# EAGLE design GPSClockISA (EAGLE 7.7.0)
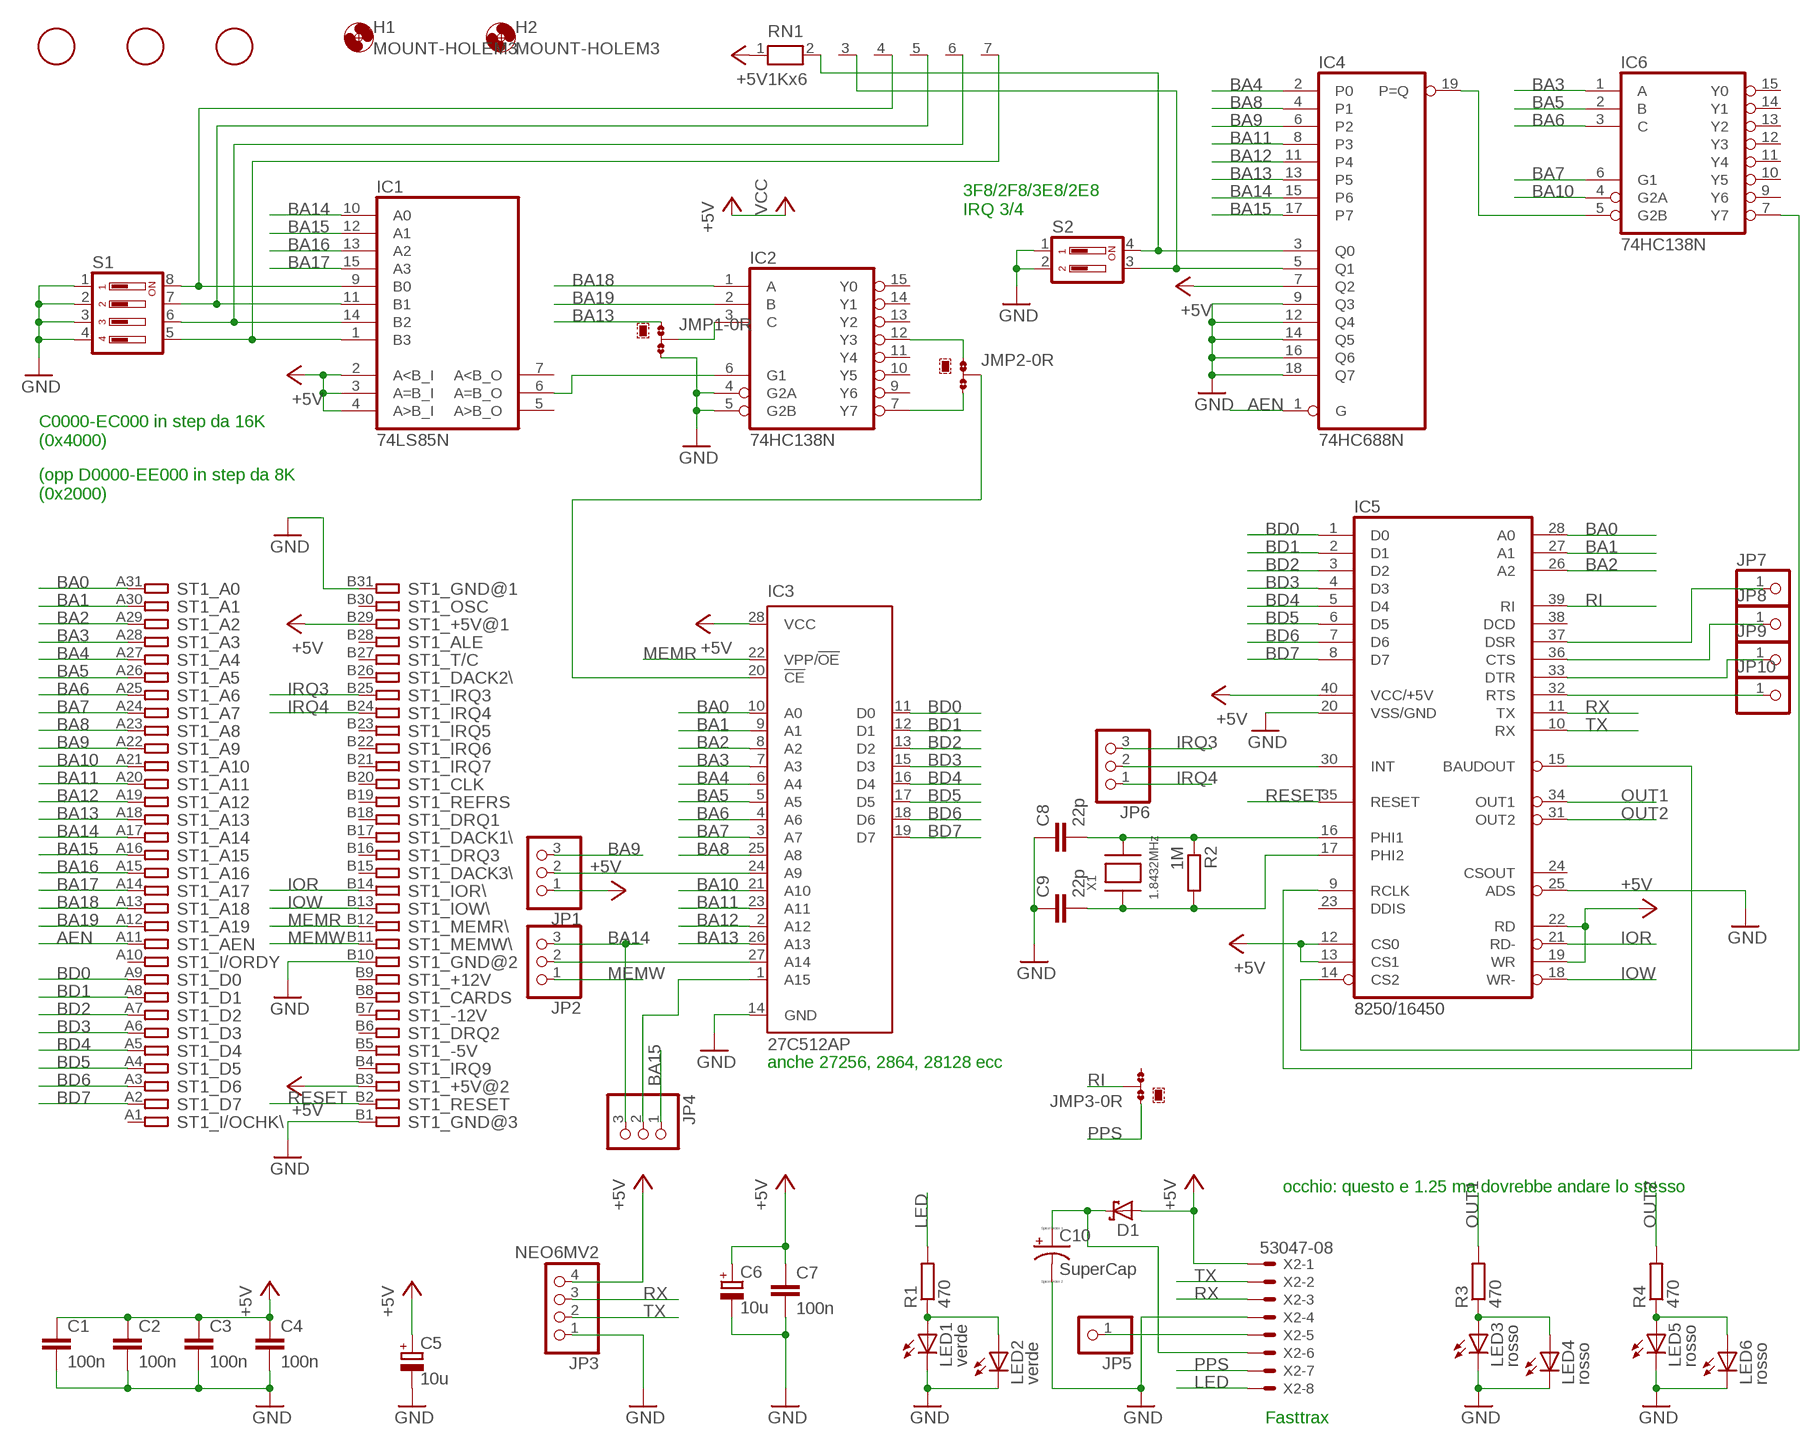
[diagram p0: schematic, sheet 1]

## Parts
C1  100n  C-EUC0805  [C0805]
C2  100n  C-EUC0805  [C0805]
C3  100n  C-EUC0805  [C0805]
C4  100n  C-EUC0805  [C0805]
C5  10u  CPOL-EUSMCD  [SMC_D]
C6  10u  CPOL-EUSMCC  [SMC_C]
C7  100n  C-EUC0805  [C0805]
C8  22p  C-EUC0805  [C0805]
C9  22p  C-EUC0805  [C0805]
C10  SuperCap  CPOL-USE10-22.5  [EB22,5D]
D1  SCHOTTKY-DIODESMC  [SMC]
F1  FIDUCIAL  [FIDUCIAL_1MM]
F2  FIDUCIAL  [FIDUCIAL_1MM]
F3  FIDUCIAL  [FIDUCIAL_1MM]
H1  MOUNT-HOLEM3  [M3]
H2  MOUNT-HOLEM3  [M3]
IC1  74LS85N  [DIL16]
IC2  74HC138N  [DIL16]
IC3  27C512AP  [DIL28-6]
IC4  74HC688N  [DIL20]
IC5  8250/16450  8250  [DIL40]
IC6  74HC138N  [DIL16]
JMP1  0R-JUMPC  [C0R-JMP]
JMP2  0R-JUMPC  [C0R-JMP]
JMP3  0R-JUMPC  [C0R-JMP]
JP1  PINHD-1X03_2.54  [1X03]
JP2  PINHD-1X03_2.54  [1X03]
JP3  NEO6MV2  PINHD-1X4  [1X04]
JP4  PINHD-1X03_2.54  [1X03]
JP5  PINHD-1X1  [1X01]
JP6  PINHD-1X03_2.54  [1X03]
JP7  PINHD-1X1  [1X01]
JP8  PINHD-1X1  [1X01]
JP9  PINHD-1X1  [1X01]
JP10  PINHD-1X1  [1X01]
LED1  verde  LEDCHIPLED_0805  [CHIPLED_0805]
LED2  verde  LED3MM  [LED3MM]
LED3  rosso  LEDCHIPLED_0805  [CHIPLED_0805]
LED4  rosso  LED3MM  [LED3MM]
LED5  rosso  LEDCHIPLED_0805  [CHIPLED_0805]
LED6  rosso  LED3MM  [LED3MM]
R1  470  R-EU_R0805  [R0805]
R2  1M  R-EU_R0805  [R0805]
R3  470  R-EU_R0805  [R0805]
R4  470  R-EU_R0805  [R0805]
RN1  1Kx6  RN06  [RN-7]
S1  DIP04YL  [DIP04YL]
S2  DIP02YL  [DIP02YL]
ST1  IBM8BIT  [IBM8BIT]
X1  1.8432MHz  XTALNX8045  [NX8045]
X2  53047-08  [53047-08]

## Nets
+5V [+3V3]: C1.1 C2.1 C3.1 C4.1 C5.+ C6.+ C7.1 D1.A IC1.2(A<B_I) IC1.3(A=B_I) IC1.4(A>B_I) IC3.28(VCC) IC4.7(Q2) IC5.12(CS0) IC5.13(CS1) IC5.19(WR) IC5.22(RD) IC5.40(VCC/+5V) JP1.1 JP3.4 RN1.1 ST1.B3 ST1.B29 X2.1
AEN: IC4.1(G) ST1.A11
BA0: IC3.10(A0) IC5.28(A0) ST1.A31
BA1: IC3.9(A1) IC5.27(A1) ST1.A30
BA2: IC3.8(A2) IC5.26(A2) ST1.A29
BA3: IC3.7(A3) IC6.1(A) ST1.A28
BA4: IC3.6(A4) IC4.2(P0) ST1.A27
BA5: IC3.5(A5) IC6.2(B) ST1.A26
BA6: IC3.4(A6) IC6.3(C) ST1.A25
BA7: IC3.3(A7) IC6.6(G1) ST1.A24
BA8: IC3.25(A8) IC4.4(P1) ST1.A23
BA9: IC4.6(P2) JP1.3 ST1.A22
BA10: IC3.21(A10) IC6.4(G2A) ST1.A21
BA11: IC3.23(A11) IC4.8(P3) ST1.A20
BA12: IC3.2(A12) IC4.11(P4) ST1.A19
BA13: IC3.26(A13) IC4.13(P5) JMP1.1 ST1.A18
BA14: IC1.10(A0) IC4.15(P6) JP2.3 JP4.3 ST1.A17
BA15: IC1.12(A1) IC4.17(P7) JP4.1 ST1.A16
BA16: IC1.13(A2) ST1.A15
BA17: IC1.15(A3) ST1.A14
BA18: IC2.1(A) ST1.A13
BA19: IC2.2(B) ST1.A12
BD0: IC3.11(D0) IC5.1(D0) ST1.A9
BD1: IC3.12(D1) IC5.2(D1) ST1.A8
BD2: IC3.13(D2) IC5.3(D2) ST1.A7
BD3: IC3.15(D3) IC5.4(D3) ST1.A6
BD4: IC3.16(D4) IC5.5(D4) ST1.A5
BD5: IC3.17(D5) IC5.6(D5) ST1.A4
BD6: IC3.18(D6) IC5.7(D6) ST1.A3
BD7: IC3.19(D7) IC5.8(D7) ST1.A2
GND [N3]: C1.2 C2.2 C3.2 C4.2 C5.- C6.- C7.2 C8.1 C9.1 C10.- IC2.4(G2A) IC2.5(G2B) IC3.14(GND) IC4.9(Q3) IC4.12(Q4) IC4.14(Q5) IC4.16(Q6) IC4.18(Q7) IC5.20(VSS/GND) IC5.25(ADS) JMP1.3 JP3.1 LED1.C LED2.K(C) LED3.C LED4.K(C) LED5.C LED6.K(C) S1.1 S1.2 S1.3 S1.4 S2.1 S2.2 ST1.B1 ST1.B10 ST1.B31 X2.4
IOR: IC5.21(RD-) ST1.B14
IOW: IC5.18(WR-) ST1.B13
IRQ3: JP6.3 ST1.B25
IRQ4: JP6.1 ST1.B24
LED: R1.2 X2.8
MEMR: IC3.22(VPP/!OE) ST1.B12
MEMW: JP2.1 ST1.B11
N$1: JP5.1 X2.5
N$2: LED3.A LED4.A R3.1
N$3: LED5.A LED6.A R4.1
N$4: IC1.9(B0) RN1.4 S1.8
N$5 [+3V3]: C10.+ D1.C X2.6
N$6: IC1.11(B1) RN1.5 S1.7
N$7: IC5.30(INT) JP6.2
N$8: IC1.14(B2) RN1.6 S1.6
N$9: LED1.A LED2.A R1.1
N$10: IC1.1(B3) RN1.7 S1.5
N$11: IC2.12(Y3) JMP2.1
N$12: IC4.19(P=Q) IC6.5(G2B)
N$13: IC3.20(!CE) JMP2.2
N$14: IC5.9(RCLK) IC5.15(BAUDOUT)
N$15: C9.2 IC5.17(PHI2) R2.2 X1.P$1
N$16: IC3.27(A14) JP2.2
N$17: C8.2 IC5.16(PHI1) R2.1 X1.P$2
N$18: IC2.3(C) JMP1.2
N$19: IC3.1(A15) JP4.2
N$20: IC4.5(Q1) RN1.3 S2.3
N$21: IC4.3(Q0) RN1.2 S2.4
N$22: IC3.24(A9) JP1.2
N$23: IC1.6(A=B_O) IC2.6(G1)
N$24: IC2.7(Y7) JMP2.3
N$25: IC5.14(CS2) IC6.7(Y7)
N$26: IC5.37(DSR) JP7.1
N$27: IC5.36(CTS) JP8.1
N$28: IC5.33(DTR) JP9.1
N$29: IC5.32(RTS) JP10.1
OUT1: IC5.34(OUT1) R3.2
OUT2: IC5.31(OUT2) R4.2
PPS: JMP3.1 X2.7
RESET: IC5.35(RESET) ST1.B2
RI: IC5.39(RI) JMP3.2
RX: IC5.11(TX) JP3.3 X2.3
TX: IC5.10(RX) JP3.2 X2.2
Unconnected: IC1.5(A>B_O) IC1.7(A<B_O) IC2.9(Y6) IC2.10(Y5) IC2.11(Y4) IC2.13(Y2) IC2.14(Y1) IC2.15(Y0) IC5.23(DDIS) IC5.24(CSOUT) IC5.38(DCD) IC6.9(Y6) IC6.10(Y5) IC6.11(Y4) IC6.12(Y3) IC6.13(Y2) IC6.14(Y1) IC6.15(Y0) JMP3.3 ST1.A1 ST1.A10 ST1.B4 ST1.B5 ST1.B6 ST1.B7 ST1.B8 ST1.B9 ST1.B15 ST1.B16 ST1.B17 ST1.B18 ST1.B19 ST1.B20 ST1.B21 ST1.B22 ST1.B23 ST1.B26 ST1.B27 ST1.B28 ST1.B30

## Notes on the sheet
- 3F8/2F8/3E8/2E8
  IRQ 3/4
- C0000-EC000 in step da 16K
  (0x4000)
- (opp D0000-EE000 in step da 8K
  (0x2000)
- anche 27256, 2864, 28128 ecc
- occhio: questo e 1.25 ma dovrebbe andare lo stesso
- Fasttrax

## Power pins joined to a net without a drawn wire
GND: IC1.8(GND) IC2.8(GND) IC4.10(GND) IC6.8(GND)
VCC: IC1.16(VCC) IC2.16(VCC) IC4.20(VCC) IC6.16(VCC)

## Library data of the parts
C1-C4 C7-C9 = resistor:C-EU: CAPACITOR, European symbol
C5 C6 = resistor:CPOL-EU: POLARIZED CAPACITOR, European symbol
C10 = resistor:CPOL-US: POLARIZED CAPACITOR, American symbol
D1 = diode:SCHOTTKY-DIODE: Schottky Diode
F1-F3 = adafruit:FIDUCIAL: For use by pick and place machines to calibrate the vision/machine, 1mm By microbuilder.eu
H1 H2 = holes:MOUNT-HOLE: MOUNTING HOLE with drill center marker
IC1 = 74xx-eu:74*85: 4-bit magnitude COMPARATOR
IC2 IC6 = 74xx-eu:74*138: 3-line to 8-line DECODER/DEMULTIPLEXER
IC3 = microchip2:27*512A: CMOS EPROM 512 K (64 K x 8); MPN: M27C512-90B6; OC_FARNELL: 1642690; OC_NEWARK: 20M6389
IC4 = 74xx-eu:74*688: 8-bit MAGNITUDE/IDENTITY COMPARATOR, totem pole
IC5 = micro-intel:8250: 8250 UART; OC_FARNELL: unknown; OC_NEWARK: unknown
JMP1-JMP3 = jump-0r-smd:0R-JUMP: SMD 0R 0805 Jumper
JP1 JP2 JP4 JP6 = pinhead-2:PINHD-1X03: PIN HEADER
JP3 = pinhead:PINHD-1X4: PIN HEADER
JP5 JP7-JP10 = pinhead:PINHD-1X1: PIN HEADER
LED1 LED3 LED5 = led:LED: LED
LED2 LED4 LED6 = adafruit:LED: LED
R1-R4 = resistor:R-EU_: RESISTOR, European symbol
RN1 = resistor-net:RN06: RESISTOR NETWORK; OC_FARNELL: unknown; OC_NEWARK: unknown
S1 = switch-dil:DIP04YL: DIL/CODE SWITCH; OC_FARNELL: unknown; OC_NEWARK: unknown
S2 = switch-dil:DIP02YL: DIL/CODE SWITCH; OC_FARNELL: unknown; OC_NEWARK: unknown
ST1 = con-pc:IBM8BIT: 8-bit CARD IBM/PC-AT
X1 = adafruit:XTAL: Low cost SMT crystals, no capacitors included http://www.ladyada.net/library/eagle
X2 = con-molex:53?-08: CONNECTOR wire to board 1.25 mm (.049 inch) pitch header; MPN: 53047-0810; OC_FARNELL: 1012258; OC_NEWARK: 98K9826

## Net classes
1 +3V3: width 0.508 mm, clearance 0.152 mm
2 N2: width 0.762 mm, clearance 0.762 mm
3 N3: width 0.508 mm
4 GND: width 0.508 mm, clearance 0.152 mm

## Board
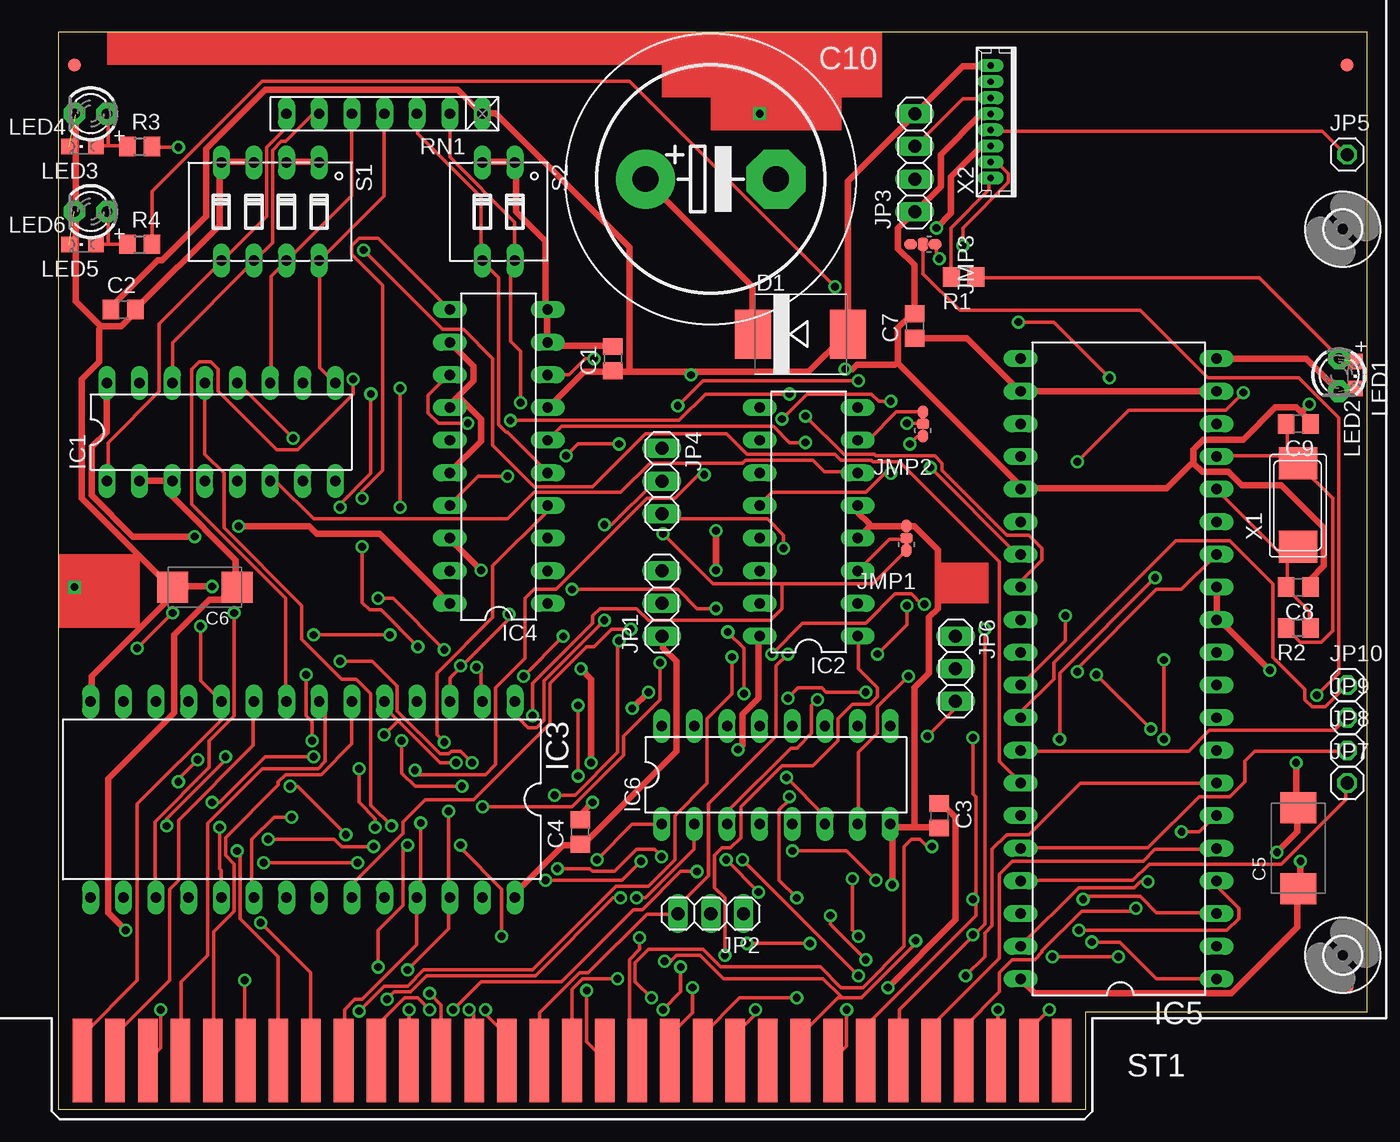
[diagram p1: board, top side]
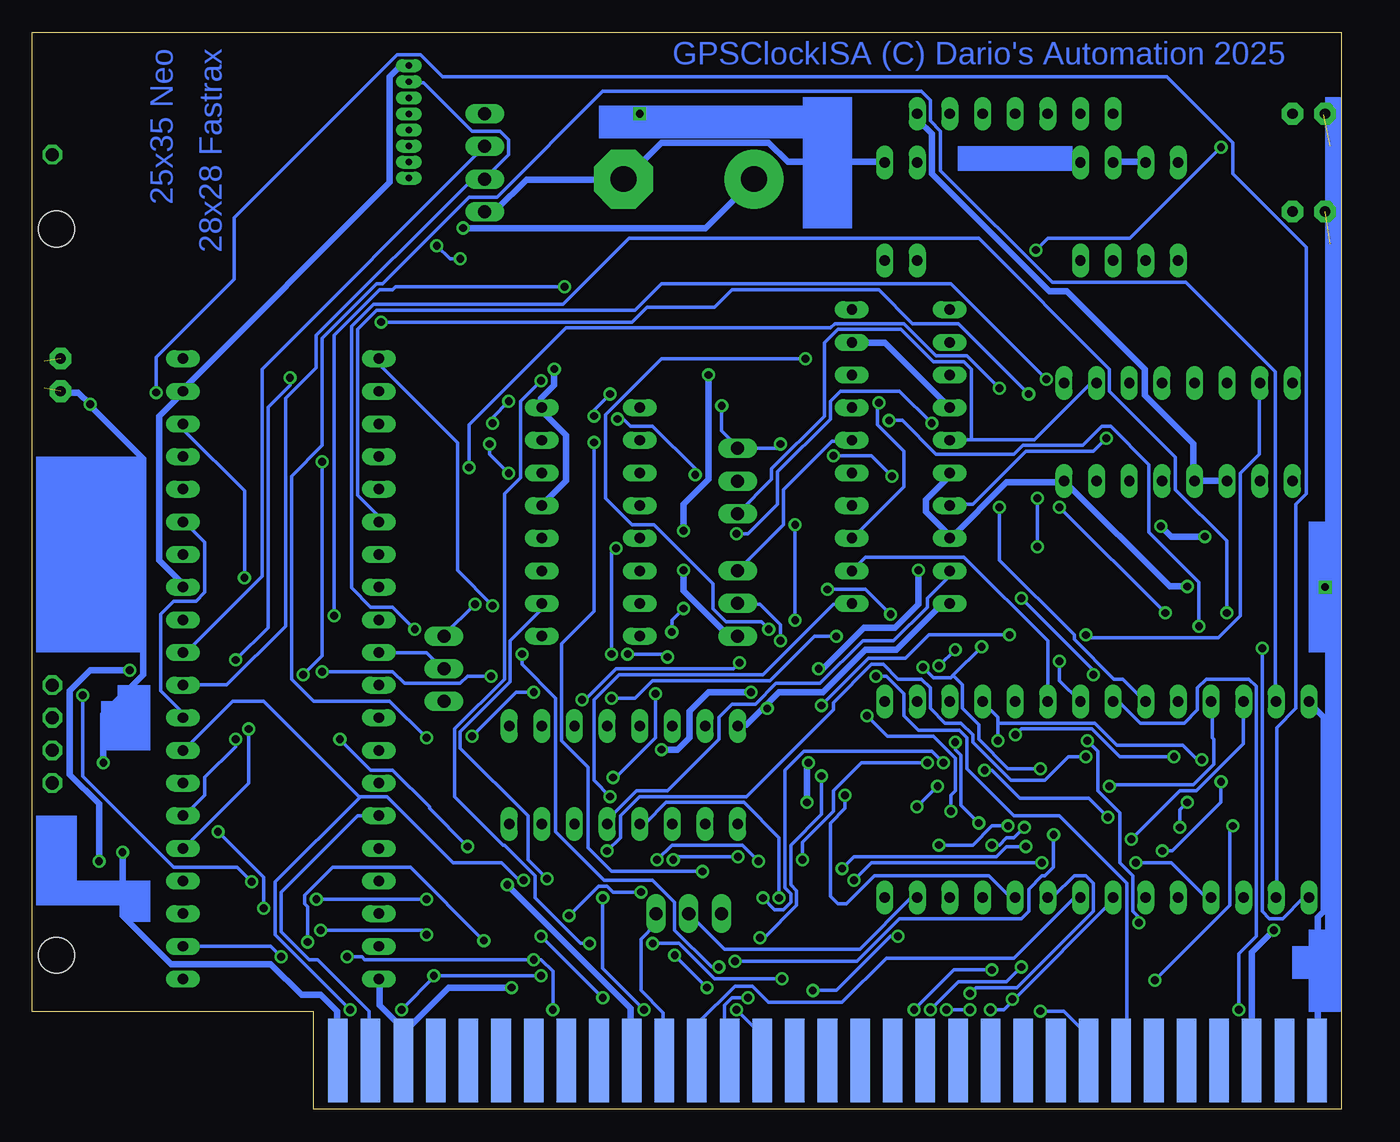
[diagram p2: board, bottom side, seen from below]

Size 101.91 x 83.81 mm. Coordinates in mm from the lower left corner, seen from the top.
Outline: 101.91,7.62 101.91,83.81 0,83.81 0,0 80.01,0 80.01,7.62 101.91,7.62
Copper layers (1*16): Top 0.035mm / dielectric 1.5mm / Bottom 0.035mm
Design rules "default": minimum track width 10mil, minimum drill 24mil, track to track 8mil, track to pad 8mil, pad to pad 8mil, via to via 8mil, smd to smd 8mil, copper to edge 40mil, drill to drill 8mil, minimum pad ring 10mil, minimum via ring 8mil, stop-mask expansion 4mil, vias tented up to drill 0mil, thermal gap 10mil

### Footprints (pad centres in the part's own frame; a part is rotated, then mirrored left to right if it is on the bottom)
C0805 = smd 1.3 x 1.5: 1 -0.95,0; 2 0.95,0
SMC_D = smd 2.4 x 2.8: + -3.15,0; - 3.15,0
SMC_C = smd 2.4 x 2.4: + -2.5,0; - 2.5,0
EB22,5D = drill 2.007 pad 4.597: + -5.08,0 | drill 2.007 pad 4.597 octagon: - 5.08,0
SMC = smd 2.8 x 3.8: A 3.7,0; C -3.7,0
FIDUCIAL_1MM = smd 1 x 1: 1 0,0
M3 = hole 2.8: 0,0
DIL16 = drill 0.813 long: 1 -8.89,-3.81; 2 -6.35,-3.81; 3 -3.81,-3.81; 4 -1.27,-3.81; 5 1.27,-3.81; 6 3.81,-3.81; 7 6.35,-3.81; 8 8.89,-3.81; 9 8.89,3.81; 10 6.35,3.81; 11 3.81,3.81; 12 1.27,3.81; 13 -1.27,3.81; 14 -3.81,3.81; 15 -6.35,3.81; 16 -8.89,3.81
DIL28-6 = drill 0.813 long: 1 -16.51,-7.62; 2 -13.97,-7.62; 3 -11.43,-7.62; 4 -8.89,-7.62; 5 -6.35,-7.62; 6 -3.81,-7.62; 7 -1.27,-7.62; 8 1.27,-7.62; 9 3.81,-7.62; 10 6.35,-7.62; 11 8.89,-7.62; 12 11.43,-7.62; 13 13.97,-7.62; 14 16.51,-7.62; 15 16.51,7.62; 16 13.97,7.62; 17 11.43,7.62; 18 8.89,7.62; 19 6.35,7.62; 20 3.81,7.62; 21 1.27,7.62; 22 -1.27,7.62; 23 -3.81,7.62; 24 -6.35,7.62; 25 -8.89,7.62; 26 -11.43,7.62; 27 -13.97,7.62; 28 -16.51,7.62
DIL20 = drill 0.813 long: 1 -11.43,-3.81; 2 -8.89,-3.81; 3 -6.35,-3.81; 4 -3.81,-3.81; 5 -1.27,-3.81; 6 1.27,-3.81; 7 3.81,-3.81; 8 6.35,-3.81; 9 8.89,-3.81; 10 11.43,-3.81; 11 11.43,3.81; 12 8.89,3.81; 13 6.35,3.81; 14 3.81,3.81; 15 1.27,3.81; 16 -1.27,3.81; 17 -3.81,3.81; 18 -6.35,3.81; 19 -8.89,3.81; 20 -11.43,3.81
DIL40 = drill 0.813 long: 1 -24.13,-7.62; 2 -21.59,-7.62; 3 -19.05,-7.62; 4 -16.51,-7.62; 5 -13.97,-7.62; 6 -11.43,-7.62; 7 -8.89,-7.62; 8 -6.35,-7.62; 9 -3.81,-7.62; 10 -1.27,-7.62; 11 1.27,-7.62; 12 3.81,-7.62; 13 6.35,-7.62; 14 8.89,-7.62; 15 11.43,-7.62; 16 13.97,-7.62; 17 16.51,-7.62; 18 19.05,-7.62; 19 21.59,-7.62; 20 24.13,-7.62; 21 24.13,7.62; 22 21.59,7.62; 23 19.05,7.62; 24 16.51,7.62; 25 13.97,7.62; 26 11.43,7.62; 27 8.89,7.62; 28 6.35,7.62; 29 3.81,7.62; 30 1.27,7.62; 31 -1.27,7.62; 32 -3.81,7.62; 33 -6.35,7.62; 34 -8.89,7.62; 35 -11.43,7.62; 36 -13.97,7.62; 37 -16.51,7.62; 38 -19.05,7.62; 39 -21.59,7.62; 40 -24.13,7.62
C0R-JMP = smd 0.8 x 1: 1 0,0.938; 3 0,-0.938 | smd 1 x 0.8: 2 0,0
1X03 = drill 1.016 long: 1 -2.54,0; 2 0,0; 3 2.54,0
1X04 = drill 1.016 long: 1 -3.81,0; 2 -1.27,0; 3 1.27,0; 4 3.81,0
1X01 = drill 1.016 octagon: 1 0,0
CHIPLED_0805 = smd 1.2 x 1.2: A 0,-1.05; C 0,1.05
LED3MM = drill 0.813 pad 1.676 octagon: A -1.27,0; K 1.27,0
R0805 = smd 1.3 x 1.5: 1 -0.95,0; 2 0.95,0
RN-7 = drill 0.813 long: 1 -7.62,0; 2 -5.08,0; 3 -2.54,0; 4 0,0; 5 2.54,0; 6 5.08,0; 7 7.62,0
DIP04YL = drill 0.813 long: 1 -3.81,-3.81; 2 -1.27,-3.81; 3 1.27,-3.81; 4 3.81,-3.81; 5 3.81,3.81; 6 1.27,3.81; 7 -1.27,3.81; 8 -3.81,3.81
DIP02YL = drill 0.813 long: 1 -1.27,-3.81; 2 1.27,-3.81; 3 1.27,3.81; 4 -1.27,3.81
IBM8BIT = smd 1.524 x 6.477: A1 -25.4,5.08; A2 -27.94,5.08; A3 -30.48,5.08; A4 -33.02,5.08; A5 -35.56,5.08; A6 -38.1,5.08; A7 -40.64,5.08; A8 -43.18,5.08; A9 -45.72,5.08; A10 -48.26,5.08; A11 -50.8,5.08; A12 -53.34,5.08; A13 -55.88,5.08; A14 -58.42,5.08; A15 -60.96,5.08; A16 -63.5,5.08; A17 -66.04,5.08; A18 -68.58,5.08; A19 -71.12,5.08; A20 -73.66,5.08; A21 -76.2,5.08; A22 -78.74,5.08; A23 -81.28,5.08; A24 -83.82,5.08; A25 -86.36,5.08; A26 -88.9,5.08; A27 -91.44,5.08; A28 -93.98,5.08; A29 -96.52,5.08; A30 -99.06,5.08; A31 -101.6,5.08 | smd 1.524 x 6.477 bottom: B1 -25.4,5.08; B2 -27.94,5.08; B3 -30.48,5.08; B4 -33.02,5.08; B5 -35.56,5.08; B6 -38.1,5.08; B7 -40.64,5.08; B8 -43.18,5.08; B9 -45.72,5.08; B10 -48.26,5.08; B11 -50.8,5.08; B12 -53.34,5.08; B13 -55.88,5.08; B14 -58.42,5.08; B15 -60.96,5.08; B16 -63.5,5.08; B17 -66.04,5.08; B18 -68.58,5.08; B19 -71.12,5.08; B20 -73.66,5.08; B21 -76.2,5.08; B22 -78.74,5.08; B23 -81.28,5.08; B24 -83.82,5.08; B25 -86.36,5.08; B26 -88.9,5.08; B27 -91.44,5.08; B28 -93.98,5.08; B29 -96.52,5.08; B30 -99.06,5.08; B31 -101.6,5.08
NX8045 = smd 2.5 x 3: P$1 3.3,0; P$2 -3.2,0
53047-08 = drill 0.5 pad 0.698 long: 1 4.375,0.45; 2 3.125,0.45; 3 1.875,0.45; 4 0.625,0.45; 5 -0.625,0.45; 6 -1.875,0.45; 7 -3.125,0.45; 8 -4.375,0.45

### Placement (x,y rotation side)
C1  43.18,58.42 90 top
C2  5.08,62.23 0 top
C3  68.58,22.86 270 top
C4  40.64,21.59 90 top
C5  96.52,20.32 90 top
C6  11.43,40.64 180 top
C7  66.67,60.96 90 top
C8  96.52,40.64 180 top
C9  96.52,53.34 180 top
C10  50.8,72.39 0 top
D1  57.78,60.33 0 top
F1  100.33,81.28 0 top
F2  1.27,81.28 0 top
F3  100.33,9.53 0 top
H1  100,68.5 0 top
H2  100,12 0 top
IC1  12.7,52.7 0 top
IC2  58.42,45.72 90 top
IC3  19.05,24.13 180 top
IC4  34.29,50.8 90 top
IC5  82.55,34.29 90 top
IC6  55.88,26.04 0 top
JMP1  66.04,44.45 180 top
JMP2  67.31,53.34 180 top
JMP3  67.31,67.31 270 top
JP1  46.99,39.37 90 top
JP2  50.8,15.24 180 top
JP3  66.67,73.66 90 top
JP4  46.99,48.9 270 top
JP5  100.33,74.3 0 top
JP6  69.85,34.29 270 top
JP7  100.33,25.4 0 top
JP8  100.33,27.94 0 top
JP9  100.33,30.48 0 top
JP10  100.33,33.02 0 top
LED1  100.97,57.15 180 top
LED2  99.69,57.15 270 top
LED3  1.91,74.93 90 top
LED4  2.54,77.47 180 top
LED5  1.91,67.31 90 top
LED6  2.54,69.85 180 top
R1  70.48,64.77 180 top
R2  96.52,37.47 180 top
R3  6.35,74.93 0 top
R4  6.35,67.31 0 top
RN1  25.4,77.47 180 top
S1  16.51,69.85 180 top
S2  34.29,69.85 180 top
ST1  103.5,-1.27 0 top
X1  96.52,46.99 90 top
X2  73.03,76.83 90 top

### Tracks (layer width: path | path; a pad name or v marks a point on that pad's centre or on a via)
+5V  (via drill 0.61)
  Top 0.508: IC1.2 6.4,48.92 8.69,48.92 IC1.3 8.91,48.81 8.91,47.66 13.83,42.75 13.83,40.69 C6.+ 13.6,40.58 12.69,39.66 11.77,39.66 9.03,36.92 9.03,30.86 3.89,25.72 3.89,15.32 v5.26,13.95 | v64.58,9.49 69.84,14.74 69.84,22.75 68.81,23.77 68.58,23.77 C3.1 | IC5.40 74.98,10.06 76.01,9.03 91.33,9.03 96.47,14.17 96.47,17.14 C5.+ 96.7,17.37 v96.7,19.32 | IC5.13 90.18,40.58 90.18,38.18 IC5.12 90.41,38.06 v94.3,34.18 | C7.1 66.75,60.01 70.75,60.01 74.87,55.89 IC5.22 75.09,55.89 90.07,55.89 IC5.19 | C2.1 4.23,62.29 4.23,62.52 7.77,66.06 8.12,66.06 11.54,69.49 11.54,74.75 16.12,79.32 31.09,79.32 32.92,77.5 RN1.1 33.26,77.5 34.06,77.5 44.46,67.09 44.46,57.38 | IC3.28 35.66,16.57 35.66,16.92 39.32,20.57 40.58,20.57 C4.1 40.8,20.57 48.12,27.89 48.12,34.86 47.09,35.89 47.09,36.8 JP1.1 | IC4.7 38.18,54.63 40.92,57.38 43.09,57.38 C1.1 43.43,57.38 44.46,57.38 | X2.1 72.47,81.15 70.41,81.15 66.75,77.5 JP3.4 66.52,77.27 61.49,72.24 61.49,60.35 D1.A 61.27,60.24 58.41,57.38 49.26,57.38 | 49.26,57.38 44.46,57.38 | v51.21,45.03 v51.21,41.95 | v49.26,57.15 49.26,57.38
  Bottom 0.508: IC1.3 8.91,48.92 11.43,48.92 IC1.4 11.54,49.15 11.54,51.78 15.32,55.55 15.32,57.61 21.37,63.66 22.75,63.66 31.89,72.81 31.89,75.89 32.92,76.92 32.92,77.38 RN1.1 | v5.26,13.95 6.97,12.23 6.97,3.89 ST1.B29 | v64.58,9.49 69.49,9.49 72.92,6.06 72.92,3.89 ST1.B3 73.04,6.29 74.87,8.12 74.87,10.06 IC5.40 | IC5.13 90.18,40.69 90.18,40.92 92.01,42.75 92.01,53.95 90.18,55.78 IC5.19 90.07,56.12 74.07,72.12 74.07,80.35 73.27,81.15 72.58,81.15 X2.1 | v51.21,41.95 51.21,40.35 47.78,36.92 47.09,36.92 JP1.1 | v51.21,45.03 51.21,47.09 49.26,49.03 v49.26,57.15 | v96.7,19.32 96.7,23.77 98.98,26.06 98.98,32.58 97.38,34.18 v94.3,34.18
AEN  (via drill 0.61)
  Top 0.254: v56.92,24.35 56.92,24.12 56.12,23.32 56.12,17.83 v57.49,16.46 | v54.29,7.77 54.29,7.43 52.81,5.94 52.81,3.89 ST1.A11
  Bottom 0.254: v56.92,24.35 58.18,25.6 58.18,31.89 56.24,33.83 45.03,33.83 39.55,39.32 38.18,39.32 IC4.1 | v57.49,16.46 57.49,10.97 v54.29,7.77
BA0  (via drill 0.61)
  Top 0.254: ST1.A31 1.94,3.89 1.94,5.83 6.17,10.06 6.17,23.77 12.69,30.29 12.69,31.66 IC3.10 12.69,31.77 11.09,33.38 v11.09,37.6 | v58.18,53.95 61.15,50.98 63.55,50.98 63.66,50.86 68.24,50.86 68.81,50.29 68.81,49.72 73.84,44.69 75.55,44.69 76.58,43.66 76.58,42.75 74.98,41.15 74.98,40.69 IC5.28 | v56.92,55.66 50.41,55.66 48.35,53.61 v35.2,53.61
  Bottom 0.254: v58.18,53.95 58.18,54.41 v56.92,55.66 | v35.2,53.61 34.18,53.61 31.55,50.98 25.49,50.98 24.8,51.66 20.12,51.66 18.63,53.15 17.95,53.15 14.97,50.18 14.97,44.92 11.09,41.03 v11.09,37.6
BA1  (via drill 0.61)
  Top 0.254: IC3.9 15.2,31.66 15.2,28.35 9.37,22.52 9.37,17.83 8.69,17.14 8.69,10.06 4.46,5.83 4.46,3.89 ST1.A30 | v67.89,49.95 74.64,43.2 74.87,43.2 IC5.27 | v26.63,46.86 v26.63,56.12
  Bottom 0.254: v67.89,49.95 67.89,53.26 60.35,60.81 39.78,60.81 39.43,61.15 34.06,61.15 31.55,58.64 29.15,58.64 v26.63,56.12 | v26.63,46.86 26.63,42.75 20.8,36.92 20.8,36.58 17.72,33.49 17.03,33.49 15.32,31.77 IC3.9
BA2  (via drill 0.61)
  Top 0.254: v8,7.77 8,4.8 7.09,3.89 ST1.A29 | v22.97,56.81 22.97,55.66 18.63,51.32 17.03,51.32 12.46,55.89 12.46,57.61 11.89,58.18 10.97,58.18 10.4,57.61 10.4,47.09 17.72,39.78 17.72,31.77 IC3.8
  Bottom 0.254: v8,7.77 8,12.12 6.63,13.49 6.63,32.92 7.2,33.49 10.52,33.49 11.2,32.8 11.2,31.09 12.23,30.06 15.66,30.06 17.26,31.66 17.72,31.66 IC3.8 | v22.97,56.81 30.4,64.24 52.92,64.24 54.98,62.18 75.09,62.18 76.58,60.69 76.58,47.78 74.98,46.18 74.98,45.72 IC5.26
BA3  (via drill 0.61)
  Top 0.254: v41.95,19.43 44.69,22.17 46.98,22.17 IC6.1 | v32.23,26.98 31.32,27.89 30.63,27.89 30.4,27.66 29.72,27.66 26.4,30.98 26.4,32.92 24.46,34.86 v21.95,34.86 | ST1.A28 9.6,3.89 9.6,9.94 11.66,12 11.66,22.29 15.89,26.52 20.23,26.52 20.8,27.09 20.8,31.2 20.34,31.66 IC3.7
  Bottom 0.254: v41.95,19.43 41.95,20.8 39.55,23.2 39.55,24.8 37.38,26.98 v32.23,26.98 | v21.95,34.86 21.95,33.38 IC3.7
BA4
  Top 0.254: IC3.6 22.86,28.46 20.46,26.06 17.72,26.06 17.14,25.49 17.14,25.26 13.03,21.14 13.03,19.77 13.72,19.09 13.72,15.43 12.12,13.83 12.12,3.89 ST1.A27
  Bottom 0.254: IC3.6 22.86,36.46 29.38,42.98 37.03,42.98 IC4.2
BA5  (via drill 0.61)
  Top 0.254: v45.03,16.46 45.72,16.46 49.49,20.23 49.49,22.17 IC6.2 | v30.98,26.98 29.72,26.98 26.46,30.23 | 26.46,30.23 25.49,31.2 25.49,31.66 IC3.5 | v14.52,10.06 14.52,3.89 ST1.A26 | v8.46,22.06 8.46,22.63 13.03,27.2 v13.03,27.43 | 26.46,30.23 v25.38,29.15
  Bottom 0.254: v45.03,16.46 44.12,15.54 43.43,15.54 42.86,16.12 42.86,16.8 43.32,17.26 43.32,26.4 41.83,27.89 31.89,27.89 v30.98,26.98 | v14.52,10.06 8.69,15.89 8.69,21.83 v8.46,22.06 | v13.03,27.43 17.26,27.43 19.43,29.6 24.92,29.6 v25.38,29.15
BA6  (via drill 0.61)
  Top 0.254: v59.09,31.89 58.64,31.43 58.64,29.26 57.49,28.12 57.04,28.12 52.12,23.2 52.12,22.29 IC6.3 | v46.86,34.75 46.86,31.89 44.01,29.03 44.01,27.55 40.01,23.55 v33.03,23.55 | v31.43,25.15 27.77,25.15 26.75,26.18 v26.75,28.69 | ST1.A25 17.14,11.89 14.17,14.86 14.17,19.89 v13.95,20.12 | v9.37,25.49 9.37,25.72 v10.86,27.2
  Bottom 0.254: v59.09,31.89 58.86,31.89 56.46,34.29 47.32,34.29 v46.86,34.75 | v31.43,25.15 v33.03,23.55 | 26.75,30.06 26.75,30.52 27.89,31.66 IC3.4 | 26.75,30.06 v26.75,28.69 | v13.95,20.12 13.14,20.12 9.37,23.89 v9.37,25.49 | v10.86,27.2 11.2,27.2 12.34,28.35 17.49,28.35 19.2,30.06 26.75,30.06
BA7  (via drill 0.61)
  Top 0.254: v56.69,25.83 59.66,22.86 59.66,22.29 IC6.6 | v53.38,32.35 53.38,35.89 v52.12,37.15 | v51.21,38.98 49.72,38.98 48.23,40.46 v40.01,40.46 | v35.09,38.52 35.09,38.18 31.38,34.46 | 31.38,34.46 30.52,33.6 30.52,31.77 IC3.3 | v15.77,14.52 19.66,10.63 19.66,3.89 ST1.A24 | v19.77,28.69 19.77,30.18 19.32,30.63 v19.32,33.83 | v24.92,39.78 26.06,39.78 v30.06,35.78 | v31.32,34.52 31.38,34.46
  Bottom 0.254: v56.69,25.83 56.46,25.83 53.38,28.92 v53.38,32.35 | v52.12,37.15 52.12,38.06 v51.21,38.98 | v40.01,40.46 37.03,40.46 v35.09,38.52 | v15.77,14.52 15.77,14.97 16.23,15.43 16.23,18.17 17.26,19.2 17.26,23.09 18.97,24.8 18.97,27.89 v19.77,28.69 | v19.32,33.83 19.32,34.18 v24.92,39.78 | v31.32,34.52 v30.06,35.78
BA8  (via drill 0.61)
  Top 0.254: ST1.A23 22.29,3.89 22.29,7.77 23.09,8.57 23.66,8.57 27.89,12.8 27.89,16.46 IC3.25 28.23,16.8 v28.23,22.29 | v30.06,28.57 29.49,29.15 29.49,33.95 33.83,38.29 33.83,42.29 38.06,46.52 38.06,46.98 IC4.4
  Bottom 0.254: v30.06,28.57 30.06,28 29.6,27.55 29.6,23.66 v28.23,22.29
BA9  (via drill 0.61)
  Top 0.254: v28.92,7.77 28,8.69 26.98,8.69 24.8,6.51 24.8,3.89 ST1.A22 | v30.75,7.77 32.92,9.94 39.2,9.94 44.81,15.54 45.49,15.54 48.46,18.52 v49.72,18.52 | v58.18,51.89 56.92,51.89 55.66,53.15 39.2,53.15 38.18,52.12 IC4.6
  Bottom 0.254: IC4.6 38.18,52.01 39.66,52.01 43.43,48.23 43.43,45.49 46.98,41.95 JP1.3 | v30.75,7.77 v28.92,7.77 | v49.72,18.52 56.81,18.52 58.64,20.34 58.64,26.63 60.69,28.69 60.69,36.23 58.18,38.75 v58.18,51.89
BA10  (via drill 0.61)
  Top 0.254: v27.32,7.77 27.32,3.89 ST1.A21 | v43.78,16.46 43.2,16.46 37.15,10.4 28.69,10.4 27.43,9.14 26.18,9.14 v25.6,8.57
  Bottom 0.254: 25.55,8.52 26.29,7.77 v27.32,7.77 | 25.55,8.52 17.83,16.23 17.83,16.46 IC3.21 | v43.78,16.46 43.78,21.14 46.52,23.89 52.58,23.89 54.18,22.29 54.52,22.29 IC6.4 | v25.6,8.57 25.55,8.52
BA11  (via drill 0.61)
  Top 0.254: v28.92,9.03 29.83,8.12 29.83,3.89 ST1.A20 | IC4.8 39.78,57.15 41.03,58.41 v41.72,58.41 | v44.58,37.38 43.09,37.38 41.72,36.01 41.15,36.01 38.29,33.15 38.29,30.06 32.35,24.12 28.57,24.12 26.86,22.4 26.86,21.49 22.86,17.49 IC3.23
  Bottom 0.254: v28.92,9.03 28.46,9.49 25.26,9.49 19.32,15.43 19.32,17.6 19.89,18.17 20.8,18.17 22.4,16.57 22.86,16.57 IC3.23 | v41.72,58.41 52.92,58.41 57.26,54.06 57.26,47.55 55.21,45.49 53.49,45.49 48.92,40.92 48.92,38.98 47.89,37.95 45.15,37.95 v44.58,37.38
BA12  (via drill 0.61)
  Top 0.254: v32.58,34.4 32.92,34.06 32.92,31.77 IC3.2 | v28,36.01 25.15,38.86 24.23,38.86 23.66,39.43 v23.66,43.78 | v23.66,47.55 23.66,48.12 25.26,49.72 25.26,64.12 22.86,66.52 22.86,67.21 23.43,67.78 24.92,67.78 30.4,62.29 IC4.11 | v32,7.77 32.35,7.43 32.35,3.89 ST1.A19 | v24.92,11.09 24.92,13.95 26.86,15.89 26.86,20.23 v27.2,20.57 | v24.69,21.95 24.69,22.63 23.43,23.89 v23.43,26.52
  Bottom 0.254: v32.58,34.4 31.77,33.6 30.4,33.6 30.23,33.78 | v28,36.01 30.23,33.78 | v23.66,47.55 v23.66,43.78 | v32,7.77 29.83,9.94 26.06,9.94 v24.92,11.09 | v27.2,20.57 26.63,20.57 26.06,21.14 25.49,21.14 v24.69,21.95 | v23.43,26.52 25.95,26.52 28.23,28.8 28.23,29.95 29.49,31.2 29.49,33.03 30.23,33.78
BA13  (via drill 0.61)
  Top 0.254: v27.2,10.86 30.4,14.06 30.4,16.46 IC3.26 30.4,16.57 v30.4,23.2 | v33.26,7.77 33.26,7.43 34.86,5.83 34.86,3.89 ST1.A18 | 56.35,40.92 50.98,40.92 v47.09,44.81 | 56.35,40.92 63.44,40.92 65.95,43.43 JMP1.1 | v31.89,53.38 29.6,53.38 28.8,54.18 28.8,55.55 30.4,57.15 IC4.13 | v36.92,30.63 36.92,33.15 41.6,37.83 41.6,38.41 42.18,38.98 45.03,38.98 45.95,38.06 55.44,38.06 56.35,38.98 56.35,40.92
  Bottom 0.254: v27.2,10.86 30.18,10.86 v33.26,7.77 | v47.09,44.81 46.18,44.81 43.89,47.09 43.89,49.61 39.78,53.72 39.78,55.09 38.98,55.89 34.4,55.89 v31.89,53.38 | v30.4,23.2 30.4,24.46 30.06,24.8 30.06,27.32 31.77,29.03 35.32,29.03 v36.92,30.63
BA14  (via drill 0.61)
  Top 0.254: ST1.A17 37.49,3.89 37.49,7.54 40.58,10.63 41.26,10.63 45.83,15.2 48.23,15.2 JP2.3 48.35,15.32 48.35,15.89 50.63,18.17 50.63,23.77 55.89,29.03 55.89,34.52 v56.81,35.43 | v56.46,43.66 56.46,44.69 55.21,45.95 47.43,45.95 47.09,46.29 JP4.3
  Bottom 0.254: 28.8,52.12 30.4,52.12 IC4.15 | 28.8,52.12 23.89,52.12 19.55,56.46 19.09,56.46 IC1.10 | 28.8,52.12 28.8,57.61 29.38,58.18 31.77,58.18 34.29,60.69 39.2,60.69 40.23,59.66 40.23,53.95 44.35,49.84 44.35,49.03 46.98,46.41 JP4.3 | v56.81,35.43 56.81,43.32 v56.46,43.66
BA15  (via drill 0.61)
  Top 0.254: v18.29,52.23 14.06,56.46 IC1.12 | v43.66,51.78 40.46,51.78 v39.55,50.86 | v34.98,49.26 32.69,49.26 30.52,47.09 IC4.17 | ST1.A16 40.01,9.37 40.8,10.17 v43.55,10.17 | v58.52,12.92 v53.61,12.92 | v62.29,56.69 50.18,56.69 v48.23,54.75
  Bottom 0.254: v18.29,52.23 19.32,51.21 24.57,51.21 28.69,47.09 30.4,47.09 IC4.17 | v43.66,51.78 44.01,51.44 JP4.1 46.98,51.55 48.23,52.81 v48.23,54.75 | v39.55,50.86 36.58,50.86 v34.98,49.26 | v43.55,10.17 48.81,10.17 51.55,12.92 v53.61,12.92 | v58.52,12.92 59.21,12.92 62.75,16.46 62.75,18.17 65.15,20.57 65.27,20.57 69.04,24.35 69.04,29.6 65.15,33.49 65.15,47.89 63.89,49.15 63.89,55.09 v62.29,56.69
BA16  (via drill 0.61)
  Top 0.254: IC1.13 11.43,50.98 12.92,49.49 12.92,45.26 18.97,39.2 18.97,36.58 22.06,33.49 23.2,33.49 24.35,32.35 24.35,23.66 v25.95,22.06 | v31.32,20.57 31.32,20.34 34.52,17.14 v34.52,13.49 | v41.15,9.26 41.15,5.26 42.52,3.89 ST1.A15
  Bottom 0.254: v25.95,22.06 27.2,22.06 28.69,20.57 v31.32,20.57 | v34.52,13.49 35.09,13.49 39.32,9.26 v41.15,9.26
BA17  (via drill 0.61)
  Top 0.254: v25.83,36.92 v19.89,36.92 | v40.46,25.95 v40.46,31.43 | v45.26,13.37 45.26,12.46 44.46,11.66 44.46,4.46 45.03,3.89 ST1.A14
  Bottom 0.254: v19.89,36.92 19.66,36.69 9.6,36.69 7.89,38.41 7.89,49.49 6.4,50.98 6.4,56.46 IC1.15 | v25.83,36.92 32.12,36.92 33.95,35.09 36.8,35.09 v40.46,31.43 | v40.46,25.95 40.46,22.97 42.86,20.57 42.86,17.49 42.41,17.03 42.41,15.89 44.92,13.37 v45.26,13.37
BA18  (via drill 0.61)
  Top 0.254: v51.89,12 51.89,16.46 51.09,17.26 51.09,19.77 51.66,20.34 52.35,20.34 53.15,21.14 53.15,23.55 56.35,26.75 58.75,26.75 60.69,28.69 60.69,30.4 61.84,31.55 63.21,31.55 63.78,32.12 63.78,32.8 62.29,34.29 62.29,36.8 IC2.1 | v49.38,9.49 49.38,7.54 47.66,5.83 47.66,3.89 ST1.A13
  Bottom 0.254: v49.38,9.49 v51.89,12
BA19  (via drill 0.61)
  Top 0.254: v61.84,17.95 61.84,13.95 v62.29,13.49 | v57.49,8.69 53.03,8.69 50.18,5.83 50.18,3.89 ST1.A12
  Bottom 0.254: v61.84,17.95 63.32,19.43 63.32,22.86 68.58,28.12 68.58,29.38 64.69,33.26 64.69,36.46 62.29,38.86 62.29,39.32 IC2.2 | v57.49,8.69 v62.29,13.49
BD0  (via drill 0.61)
  Top 0.254: v80.47,13.03 82.64,13.03 85.5,10.17 90.07,10.17 IC5.1 | v66.75,13.14 66.75,12.92 62.52,8.69 60.92,8.69 | 60.92,8.69 60.69,8.69 57.84,5.83 57.84,3.89 ST1.A9 | v18.06,25.15 18.63,25.15 v22.4,21.37 | v47.21,11.54 47.66,11.54 48.12,12 49.95,12 51.78,10.17 59.55,10.17 60.92,8.8 60.92,8.69
  Bottom 0.254: v80.47,13.03 80.47,15.77 80.7,16 80.7,16.69 78.52,18.86 72.47,18.86 v66.75,13.14 | v18.06,25.15 17.95,25.26 11.54,25.26 9.94,26.86 9.94,28.8 10.06,28.92 10.06,31.66 IC3.11 | v22.4,21.37 22.4,18.86 23.09,18.17 23.32,18.17 24.35,17.14 24.35,15.43 24.92,14.86 34.4,14.86 37.72,11.54 v47.21,11.54
BD1  (via drill 0.61)
  Top 0.254: v16.34,21.03 21.49,21.03 22.06,20.46 v24.57,20.46 | v38.86,18.75 41.38,18.75 41.6,18.52 43.32,18.52 45.03,20.23 46.41,20.23 v46.98,19.66 | v54.52,16.92 v52.01,19.43 | v60.12,15.09 60.12,14.4 v62.87,11.66 | v61.38,7.77 61.38,4.92 60.35,3.89 ST1.A8 | v77.38,11.89 v82.53,11.89
  Bottom 0.254: v16.34,21.03 12.57,24.8 11.32,24.8 7.66,28.46 7.66,31.66 IC3.12 | v24.57,20.46 26.06,20.46 26.86,19.66 37.95,19.66 v38.86,18.75 | v46.98,19.66 51.78,19.66 v52.01,19.43 | v54.52,16.92 56.69,16.92 57.15,17.37 57.84,17.37 v60.12,15.09 | v61.38,7.77 61.38,10.74 62.29,11.66 v62.87,11.66 76.01,11.66 76.24,11.89 v77.38,11.89 | v82.53,11.89 83.33,12.69 90.07,12.69 IC5.2
BD2  (via drill 0.61)
  Top 0.254: v71.21,28.92 71.21,24.57 71.44,24.35 71.44,16.34 | 71.44,16.34 71.44,15.09 62.87,6.51 ST1.A7 | v79.78,16.34 80.01,16.57 84.24,16.57 85.5,15.32 90.07,15.32 IC5.3 | v71.21,16.34 71.44,16.34
  Bottom 0.254: v71.21,28.92 74.07,31.77 80.01,31.77 81.72,33.49 81.72,49.26 79.32,51.66 79.32,60.01 75.09,64.24 74.64,64.24 67.89,70.98 65.72,70.98 57.49,79.21 32.69,79.21 32,78.52 32,76.92 31.2,76.12 31.2,73.04 22.52,64.35 12.12,64.35 5.14,57.38 5.14,31.77 IC3.13 | v71.21,16.34 v79.78,16.34
BD3  (via drill 0.61)
  Top 0.254: v8.91,38.63 v6.17,35.89 | v72.12,37.38 72.12,14.4 71.27,13.54 | 71.27,13.54 65.49,7.77 65.49,3.89 ST1.A6 | v79.44,13.95 90.98,13.95 91.9,14.86 91.9,15.66 90.18,17.37 90.18,17.72 IC5.4 | v71.21,13.6 71.27,13.54
  Bottom 0.254: v6.17,35.89 6.17,15.43 5.6,14.86 4.57,14.86 2.97,16.46 2.63,16.46 IC3.15 | v8.91,38.63 8.91,44.23 12.92,48.23 12.92,50.75 18.06,55.89 18.06,57.61 28.23,67.78 55.44,67.78 60.58,62.64 75.32,62.64 77.04,60.92 77.04,40.58 75.55,39.09 73.84,39.09 v72.12,37.38 | v79.44,13.95 71.55,13.95 v71.21,13.6
BD4  (via drill 0.61)
  Top 0.254: v92.24,55.78 90.87,54.41 83.33,54.41 v79.32,50.41 | v85.04,29.6 v80.81,33.83 | ST1.A5 68.01,3.89 68.01,6.51 73.27,11.77 73.27,18.29 74.3,19.32 84.47,19.32 85.38,20.23 90.07,20.23 IC5.5
  Bottom 0.254: v92.24,55.78 92.24,58.52 86.18,64.58 86.18,69.38 73.5,82.07 71.67,82.07 69.95,80.35 13.6,80.35 8.46,75.21 8.46,72.81 2.74,67.09 2.74,47.89 3.54,47.09 3.54,31.2 5.03,29.72 5.03,16.57 IC3.16 | v79.32,50.41 79.32,35.32 v80.81,33.83 | v85.04,29.6 85.04,25.38 90.07,20.34 IC5.5
BD5  (via drill 0.61)
  Top 0.254: v13.72,38.63 13.72,30.63 11.77,28.69 11.77,26.63 7.54,22.4 7.54,16.57 IC3.17 | v21.95,46.86 21.95,47.09 24.35,49.49 v24.35,55.66 | v74.75,61.27 77.5,61.27 v81.84,56.92 | v86.07,28.8 v86.07,34.98 | v83.9,15.66 83.67,15.43 79.67,15.43 76.58,12.34 76.58,12.23 76.01,11.66 74.3,11.66 73.27,10.63 73.27,9.14 70.52,6.4 70.52,3.89 ST1.A4 | v87.44,21.6 88.81,21.6 90.07,22.86 IC5.6
  Bottom 0.254: v21.95,46.86 v13.72,38.63 | v24.35,55.66 29.83,61.15 33.38,61.15 36.01,63.78 47.43,63.78 48.81,62.41 54.06,62.41 55.21,61.27 v74.75,61.27 | v81.84,56.92 81.84,56.35 83.55,54.63 83.55,37.49 v86.07,34.98 | v86.07,28.8 86.07,28.23 88.47,25.83 88.47,24.46 90.07,22.86 IC5.6 | v83.9,15.66 83.9,18.06 v87.44,21.6
BD6  (via drill 0.61)
  Top 0.254: v23.32,19.2 v16,19.2 | v37.95,17.83 43.89,17.83 v45.38,19.32 | v62.29,10.4 v53.26,19.43 | v73.15,7.77 73.15,4 73.04,3.89 ST1.A3 | v70.64,10.4 72.12,11.89 72.12,13.72 72.69,14.29 72.69,20.23 73.84,21.37 75.55,21.37 79.55,25.38 90.07,25.38 IC5.7
  Bottom 0.254: v16,19.2 13.26,19.2 10.63,16.57 10.17,16.57 IC3.18 | v23.32,19.2 36.58,19.2 v37.95,17.83 | v45.38,19.32 46.63,20.57 52.12,20.57 v53.26,19.43 | 70.52,10.4 v62.29,10.4 | v73.15,7.77 70.52,10.4 | v70.64,10.4 70.52,10.4
BD7  (via drill 0.61)
  Top 0.254: v12.57,21.95 12.57,18.75 12.69,18.63 12.69,16.57 IC3.19 | v12,23.89 12.57,23.89 16.12,27.43 v19.89,27.43 | v57.15,20.12 61.38,20.12 v63.66,17.83 | v77.15,7.77 75.67,6.29 75.67,3.89 ST1.A2
  Bottom 0.254: v12.57,21.95 12.57,23.32 v12,23.89 | v19.89,27.43 21.26,27.43 23.09,25.6 25.72,25.6 28.69,28.57 28.69,29.15 29.6,30.06 30.86,30.06 32,31.2 32,32.8 32.69,33.49 34.52,33.49 35.66,34.63 36.58,34.63 39.55,31.66 39.55,31.09 46.29,24.35 54.63,24.35 56.12,22.86 56.12,21.14 v57.15,20.12 | v63.66,17.83 64.01,17.83 65.38,19.2 69.15,19.2 74.3,24.35 76.47,24.35 | 76.47,24.35 83.9,31.77 86.3,31.77 90.07,28 IC5.8 | v77.15,7.77 82.98,13.6 82.98,17.72 76.47,24.23 76.47,24.35
GND  (via drill 0.61)  (3 unrouted)
  Top 0.508: S1.3 15.2,73.72 12.8,73.72 S1.4 12.57,73.5 12.57,68.81 6.17,62.41 C2.2 5.94,62.18 5.94,61.95 4.92,60.92 3.31,60.92 | S1.2 17.83,73.72 20.23,73.72 S1.1 | 3.31,60.92 1.37,62.87 1.37,69.84 LED6.K 1.37,70.07 1.37,77.38 LED4.K | C6.- 8.91,40.58 8.91,40.01 2.63,33.72 2.63,31.77 IC3.14 | 3.31,60.92 3.2,60.69 3.2,58.18 1.83,56.81 1.83,47.55 8.69,40.69 C6.- | S2.2 33.03,73.72 35.55,73.72 S2.1 35.66,73.5 35.66,69.84 37.95,67.55 37.95,62.41 IC4.10 38.06,62.18 38.06,59.89 IC4.9 38.18,59.66 38.41,59.44 43.09,59.44 C1.2 | 31.15,55.49 32.35,56.69 32.35,57.84 30.52,59.66 IC4.12 | 31.15,55.49 30.52,54.86 30.52,54.63 IC4.14 | v41.6,23.89 40.69,22.97 40.69,22.63 C4.2 | v41.49,26.98 41.49,33.49 v40.69,34.29 | v32.92,41.95 30.52,44.35 IC4.18 | 31.15,55.49 32.92,53.72 32.92,52.01 30.52,49.61 IC4.16 | 66.64,21.95 65.04,21.95 64.81,22.17 IC6.8 64.92,21.72 v64.92,17.49 | 66.64,21.95 68.58,21.95 C3.2 | 63.21,45.38 65.95,45.38 JMP1.3 66.29,45.38 66.64,45.38 68.47,43.55 68.47,38.98 67.78,38.29 67.78,33.95 66.64,32.8 66.64,21.95 | 63.21,45.38 62.29,44.46 IC2.4 | IC2.5 62.29,46.98 62.29,46.41 63.09,45.61 63.21,45.38 | v94.87,20 96.47,21.6 96.47,23.43 C5.- 96.36,23.66 v96.36,26.98 | X2.4 72.47,77.38 71.78,77.38 68.69,74.3 68.69,71.78 66.86,69.95 JP3.1 66.64,69.84 65.38,68.58 65.38,66.98 66.64,65.72 66.64,61.95 C7.2 66.41,61.84 65.38,60.81 65.38,58.06 | IC5.20 90.18,58.41 97.16,58.41 99.67,55.89 LED2.K | 88.35,50.29 89.04,49.61 91.1,49.61 92.13,48.58 95.21,48.58 98.53,45.26 98.53,42.29 97.5,41.26 97.5,40.69 C8.1 | 88.35,50.29 88.35,51.32 89.15,52.12 92.24,52.12 94.75,54.63 96.36,54.63 96.75,54.23
  Top 0.508: 96.75,54.23 97.38,53.61 97.38,53.38 C9.1 | 88.35,50.29 88.12,50.18 86.3,48.35 74.98,48.35 IC5.25 74.87,48.58 65.38,58.06 | 96.75,54.23 v97.38,54.86 | v61.27,57.61 61.84,57.61 62.18,57.95 65.15,57.95 65.38,58.06 | v12,40.69 9.14,40.69 C6.-
  Bottom 0.508: S1.3 15.32,73.72 17.72,73.72 S1.2 | ST1.B31 1.83,3.89 1.83,14.97 1.37,15.43 1.37,30.52 2.52,31.66 IC3.14 | v41.6,23.89 41.6,26.86 v41.49,26.98 | v40.69,34.29 40.35,34.29 37.15,37.49 34.75,37.49 32.92,39.32 v32.92,41.95 | IC4.16 30.52,49.49 30.52,49.26 32.35,47.43 32.35,46.52 30.52,44.69 IC4.18 30.4,44.46 26.06,48.81 21.6,48.81 IC1.8 21.37,48.69 13.37,40.69 v12,40.69 | IC4.9 38.06,59.66 35.55,59.66 30.52,54.63 IC4.14 | IC2.5 62.18,47.09 60.35,48.92 60.35,52.46 62.18,54.29 62.18,54.52 IC2.8 62.29,54.86 62.29,55.32 61.27,56.35 v61.27,57.61 | v64.92,17.49 55.32,7.89 55.32,3.89 ST1.B10 | v94.87,20 94.87,15.09 91.1,11.32 83.33,11.32 80.92,8.91 79.44,8.91 78.18,7.66 78.18,3.89 ST1.B1 | JP3.1 66.64,69.95 65.84,69.95 63.44,72.35 55.89,72.35 C10.- 55.66,72.47 52.92,75.21 44.58,75.21 43.09,73.72 35.66,73.72 S2.1 | LED2.K 99.67,55.78 98.3,55.78 v97.38,54.86 97.27,54.63 93.27,50.63 93.27,33.83 96.36,30.75 v96.36,26.98
IOR  (via drill 0.61)
  Top 0.254: v66.06,39.2 66.06,37.72 v63.78,35.43 | v48.46,11.09 48.46,9.14 v47.09,7.77
  Bottom 0.254: v66.06,39.2 68.81,41.95 68.81,51.89 74.87,57.95 74.87,58.41 IC5.21 | v63.78,35.43 63.78,34.63 61.15,32 61.15,21.6 57.38,17.83 53.61,17.83 51.89,16.12 51.89,13.95 49.03,11.09 v48.46,11.09 | v47.09,7.77 45.15,5.83 45.15,3.89 ST1.B14
IOW  (via drill 0.61)
  Top 0.254: v85.38,41.38 77.95,33.95 v77.95,28.8 | v68.01,20.46 67.67,20.46 67.09,21.03 66.41,21.03 65.84,20.46 65.84,12.69 62.64,9.49 60.92,9.49 59.32,11.09 51.55,11.09 50.18,12.46 45.95,12.46 44.92,11.43 44.92,9.94 v46.18,8.69
  Bottom 0.254: v85.38,41.38 85.38,48.12 90.07,52.81 90.07,53.26 IC5.18 | v77.95,28.8 75.55,26.4 73.84,26.4 70.98,23.55 70.98,23.43 v68.01,20.46 | v46.18,8.69 47.43,8.69 48.01,8.12 48.01,4.23 47.66,3.89 ST1.B13
IRQ3  (via drill 0.61)
  Top 0.254: v67.67,29.03 69.84,31.2 69.84,31.66 JP6.3 | v62.87,32.46 59.78,32.46 59.44,32.8 57.61,32.8 v56.81,32 | v36.23,33.72 v39.32,36.8
  Bottom 0.254: v67.67,29.03 64.24,32.46 v62.87,32.46 | v56.81,32 54.98,32 53.61,33.38 44.46,33.38 41.03,36.8 v39.32,36.8 | v36.23,33.72 35.43,33.72 34.06,32.35 34.06,30.63 32.92,29.49 29.72,29.49 29.15,28.92 29.15,26.52 25.49,22.86 21.95,22.86 16.69,17.6 16.69,4.34 17.14,3.89 ST1.B25
IRQ4  (via drill 0.61)
  Top 0.254: v67.44,39.32 67.21,39.32 66.41,40.12 65.15,40.12 62.87,37.83 57.95,37.83 v55.55,35.43 | v52.46,35.2 52.46,32.35 50.52,30.4 50.52,25.38 48.01,22.86 48.01,19.43 45.95,17.37 43.43,17.37 36.92,10.86 28.46,10.86 27.2,9.6 25.38,9.6 v23.43,7.66
  Bottom 0.254: v67.44,39.32 69.84,36.92 JP6.1 | v55.55,35.43 52.69,35.43 v52.46,35.2 | v23.43,7.66 21.6,7.66 19.77,5.83 19.77,3.89 ST1.B24
LED
  Top 0.254: R1.2 69.49,64.81 69.49,68.58 72.47,71.55 72.47,72.35 X2.8
MEMR
  Bottom 0.254: IC3.22 20.34,16.46 20.8,16.46 25.49,11.77 35.43,11.77 38.86,8.34 44.58,8.34 45.83,9.6 47.21,9.6 50.06,6.74 50.06,3.89 ST1.B12
MEMW
  Bottom 0.254: JP2.1 53.38,15.2 53.38,14.4 54.52,13.26 54.52,9.26 52.81,7.54 52.81,3.89 ST1.B11
N$1
  Top 0.254: X2.5 72.58,76.12 98.41,76.12 100.24,74.3 JP5.1
N$2
  Top 0.254: 3.89,74.98 5.37,74.98 R3.1 | 3.89,74.98 2.97,74.98 LED3.A | 3.89,74.98 3.89,77.38 LED4.A
N$3
  Top 0.254: 3.89,67.32 5.37,67.32 R4.1 | 3.89,67.32 2.97,67.32 LED5.A | 3.89,67.32 3.89,69.84 LED6.A
N$4
  Top 0.254: IC1.9 21.49,56.58 20.34,57.72 20.34,65.95 S1.8 25.38,71.09 25.38,77.38 RN1.4
N$5  (via drill 0.61)
  Top 0.508: v68.35,68.58 69.49,69.72 69.49,72.58 71.78,74.87 72.47,74.87 X2.6 | D1.C 54.06,60.35 54.06,64.01 45.72,72.35 C10.+
  Bottom 0.508: v68.35,68.58 49.49,68.58 45.72,72.35 C10.+
N$6
  Top 0.254: IC1.11 16.57,56.58 16.57,64.81 17.72,65.95 S1.7 17.83,66.06 22.86,71.09 RN1.5
N$7
  Bottom 0.254: IC5.30 74.87,35.55 71.21,35.55 69.95,34.29 JP6.2
N$8
  Top 0.254: IC1.14 8.91,56.58 8.91,59.66 15.2,65.95 S1.6 15.32,66.06 16.69,67.44 16.69,74.64 17.37,75.32 17.72,75.32 19.77,77.38 20.23,77.38 RN1.6
N$9  (1 unrouted)
  Top 0.254: R1.1 71.44,64.69 93.5,64.69 99.67,58.52 LED2.A
N$10
  Top 0.254: IC1.1 3.89,48.92 3.89,51.89 7.89,55.89 7.89,61.15 12.69,65.95 S1.5 12.8,66.06 16.23,69.49 16.23,74.87 17.72,76.35 17.72,77.38 RN1.7
N$11  (via drill 0.61)
  Top 0.254: v66.29,51.78 66.86,52.35 67.21,52.35 JMP2.1 | v64.81,49.49 64.35,49.49 62.87,48.01 55.55,48.01 54.63,47.09 IC2.12
  Bottom 0.254: v66.29,51.78 66.29,50.98 v64.81,49.49
N$12
  Bottom 0.254: IC6.5 57.15,22.52 54.86,24.8 52.46,24.8 48.46,28.8 48.46,30.52 47.43,31.55 45.61,31.55 44.01,33.15 40.58,33.15 37.26,36.46 34.86,36.46 32.23,39.09 32.23,39.78 30.52,41.49 30.52,41.83 IC4.19
N$13  (via drill 0.61)
  Top 0.254: v66.06,53.38 67.21,53.38 JMP2.2 | v64.81,55.09 63.89,55.09 63.32,55.66 58.29,55.66 v56.35,53.72 | v50.29,49.38 49.84,49.38 48.01,47.55 45.83,47.55 38.75,40.46 37.03,40.46 36.35,39.78 36.35,35.09 34.06,32.8 34.06,26.86 33.26,26.06 28.12,26.06 v27.77,26.4 | v18.17,22.75 16.8,22.75 15.09,21.03 15.09,16.69 15.2,16.57 IC3.20
  Bottom 0.254: v66.06,53.38 66.06,53.84 v64.81,55.09 | v56.35,53.72 55.89,53.72 55.32,53.15 53.61,53.15 50.29,49.84 v50.29,49.38 | v27.77,26.4 27.2,26.4 25.03,24.23 19.66,24.23 v18.17,22.75
N$14
  Bottom 0.254: IC5.9 90.18,30.52 90.18,30.86 91.9,32.58 91.9,38.52 90.87,39.55 89.15,39.55 88.47,40.23 88.47,44.12 90.07,45.72 IC5.15
N$15
  Top 0.254: R2.2 95.67,37.38 96.7,36.35 98.3,36.35 99.21,37.26 99.21,47.55 96.58,50.18 X1.P$1 | C9.2 95.67,53.26 95.67,51.21 96.47,50.41 X1.P$1 | IC5.17 90.18,50.86 95.21,50.86 95.56,51.21 X1.P$1
N$16
  Bottom 0.254: IC3.27 33.03,16.46 33.49,16.46 37.49,12.46 48.01,12.46 50.75,15.2 JP2.2
N$17
  Top 0.254: R2.1 97.38,37.49 97.38,38.75 95.56,40.58 C8.2 95.67,40.69 95.67,42.98 96.47,43.78 X1.P$2 95.56,42.86 90.18,48.23 IC5.16
N$18
  Top 0.254: JMP1.2 65.95,44.35 64.69,44.35 62.29,41.95 IC2.3
N$19  (via drill 0.61)
  Top 0.254: v42.52,38.06 37.83,33.38 37.83,30.29 37.26,29.72 36.58,29.72 35.66,30.63 35.66,31.66 IC3.1 | v42.52,45.49 43.09,45.49 46.41,48.81 46.98,48.81 JP4.2
  Bottom 0.254: v42.52,45.49 v42.52,38.06
N$20
  Top 0.254: RN1.3 28,77.38 28,75.89 32.92,70.98 32.92,66.06 S2.3 33.03,65.95 34.29,64.69 34.29,53.26 34.86,52.69 34.98,52.69 38.06,49.61 IC4.5
N$21  (via drill 0.61)
  Top 0.254: RN1.2 30.52,77.38 30.52,74.07 35.55,69.04 35.55,66.06 S2.4 35.55,65.95 35.2,65.61 35.2,59.78 36.01,58.98 v36.01,54.98
  Bottom 0.254: v36.01,54.98 36.12,54.86 36.12,53.26 34.06,51.21 34.06,48.46 38.06,44.46 IC4.3
N$22  (via drill 0.61)
  Top 0.254: v38.63,24.46 40.23,24.46 43.55,27.77 43.55,36.35 v43.66,36.46
  Bottom 0.254: v38.63,24.46 38.63,23.43 39.78,22.29 39.78,16.57 39.2,16 38.52,16 36.35,18.17 27.43,18.17 25.83,16.57 25.49,16.57 IC3.24 | v43.66,36.46 43.66,37.72 45.26,39.32 46.98,39.32 JP1.2
N$23
  Top 0.254: IC1.6 16.57,48.81 17.03,48.81 19.89,45.95 34.98,45.95 37.03,48.01 43.78,48.01 46.06,50.29 53.26,50.29 53.49,50.52 58.75,50.52 59.66,49.61 62.18,49.61 IC2.6
N$24
  Top 0.254: JMP2.3 67.21,54.29 65.27,54.29 63.09,52.12 62.29,52.12 IC2.7
N$25  (via drill 0.61)
  Top 0.254: v66.18,33.72 63.78,31.32 63.78,29.26 62.29,27.77 62.29,22.29 IC6.7 | v79.32,34.06 79.32,34.29 85.5,40.46 87.44,40.46 90.07,43.09 IC5.14
  Bottom 0.254: v66.18,33.72 68.01,33.72 68.58,33.15 72.92,33.15 73.84,34.06 v79.32,34.06
N$26
  Top 0.254: IC5.37 74.98,17.83 83.67,17.83 84.92,19.09 95.21,19.09 100.24,24.12 100.24,25.38 JP7.1
N$27
  Top 0.254: IC5.36 74.98,20.34 84.81,20.34 88.81,24.35 91.21,24.35 92.35,25.49 92.35,27.09 93.15,27.89 100.24,27.89 JP8.1
N$28
  Top 0.254: IC5.33 74.98,27.89 88.01,27.89 89.61,29.49 99.33,29.49 100.24,30.4 JP9.1
N$29
  Top 0.254: IC5.32 74.98,30.52 74.98,30.98 77.5,33.49 77.5,34.75 86.98,44.23 91.21,44.23 94.53,40.92 94.53,35.2 97.04,32.69 97.04,31.89 97.61,31.32 98.64,31.32 100.24,32.92 JP10.1
N$30  (via drill 0.6)
  other vias: 1.27,40.64
N$31  (via drill 0.6)
  other vias: 54.61,77.47
OUT1  (via drill 0.61)
  Top 0.254: v9.37,74.87 7.32,74.87 R3.2 | v23.77,66.86 29.95,60.69 31.55,60.69 33.83,58.41 33.83,51.66 37.03,48.46 41.6,48.46 45.72,52.58 52.01,52.58 53.61,50.98 60.47,50.98 60.92,50.52 63.32,50.52 63.44,50.41 65.49,50.41 73.27,42.63 73.27,27.09 74.87,25.49 IC5.34
  Bottom 0.254: v9.37,74.87 16.46,67.78 22.86,67.78 v23.77,66.86
OUT2  (via drill 0.61)
  Top 0.254: v60.47,64.01 44.46,80.01 15.89,80.01 7.32,71.44 7.32,67.32 R4.2 | v78.41,38.41 78.41,36.46 74.98,33.03 IC5.31
  Bottom 0.254: v60.47,64.01 73.61,64.01 73.84,63.78 74.87,63.78 78.41,60.24 v78.41,38.41
PPS  (via drill 0.61)
  Top 0.254: v68.58,66.18 68.35,66.41 68.35,67.21 JMP3.1 | v70.41,67.21 70.41,68.58 73.95,72.12 73.95,72.81 73.15,73.61 72.58,73.61 X2.7
  Bottom 0.254: v68.58,66.18 69.38,66.18 v70.41,67.21
RESET
  Bottom 0.254: IC5.35 76.58,22.86 82.53,16.92 82.53,13.83 80.35,11.66 79.67,11.66 75.67,7.66 75.67,3.89 ST1.B2
RI  (via drill 0.61)
  Top 0.254: v97.95,32.23 99.67,33.95 99.67,53.84 96.58,56.92 89.5,56.92 84.24,62.18 70.18,62.18 67.32,65.04 67.32,67.21 JMP3.2 | v84.81,17.72 84.24,17.72 83.78,17.26 79.44,17.26 74.98,12.8 IC5.39
  Bottom 0.254: v97.95,32.23 97.95,25.95 90.87,18.86 85.95,18.86 v84.81,17.72
RX
  Top 0.254: X2.3 72.47,78.64 70.41,78.64 66.75,74.98 JP3.3
  Bottom 0.254: IC5.11 90.07,35.66 89.84,35.66 84.01,41.49 84.01,57.61 66.75,74.87 JP3.3
TX
  Bottom 0.254: X2.2 72.47,79.9 71.44,79.9 67.67,76.12 65.49,76.12 64.81,75.44 64.81,74.3 66.64,72.47 JP3.2 66.75,72.35 67.67,72.35 79.78,60.24 79.78,57.72 82.18,55.32 82.18,37.6 86.75,33.03 90.07,33.03 IC5.10
VCC  (via drill 0.61)
  Top 0.508: v52.92,28 53.26,28.35 53.26,30.75 54.52,32 54.52,36.8 IC2.16 | v44.69,31.2 v45.95,32.46 | v10.63,44.58 5.83,44.58 2.63,47.78 2.63,51.55 3.77,52.69 3.77,56.46 IC1.16 | v14.06,45.38 19.55,45.38 20.12,44.81 25.03,44.81 30.4,39.43 IC4.20
  Bottom 0.508: 44.86,31.38 46.29,29.95 46.98,29.95 IC6.16 | 44.86,31.38 43.78,32.46 40.35,32.46 37.03,35.78 34.63,35.78 31.09,39.32 30.52,39.32 IC4.20 | v52.92,28 51.66,28 50.75,28.92 50.75,30.98 49.26,32.46 v45.95,32.46 | v44.69,31.2 44.86,31.38 | v10.63,44.58 13.26,44.58 v14.06,45.38
(copper drawn outside any net)
  shapes: Bottom area x17, Top area x5

### Text on the board
Bottom: 28x28 Fastrax | 25x35 Neo | GPSClockISA (C) Dario's Automation 2025